# EAGLE design main_new (EAGLE 7.7.0)
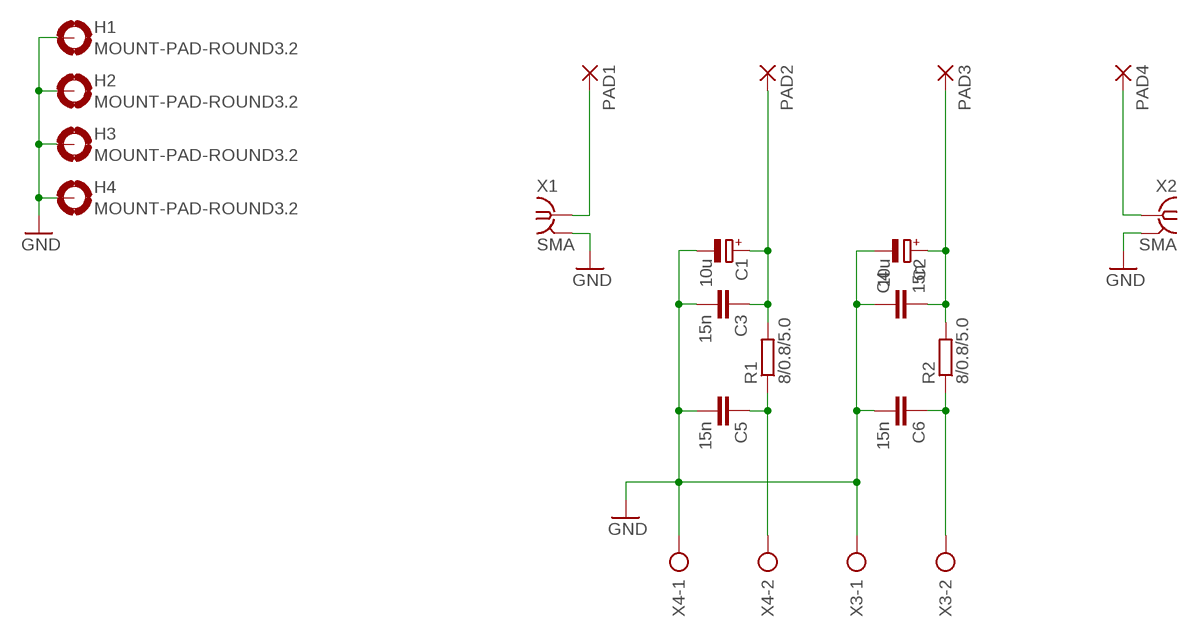
[diagram p0: schematic, sheet 1]

## Parts
C1  10u  CPOL-EUE5-8.5  [E5-8,5]
C2  10u  CPOL-EUE5-8.5  [E5-8,5]
C3  15n  C-EU050-030X075  [C050-030X075]
C4  15n  C-EU050-030X075  [C050-030X075]
C5  15n  C-EU050-030X075  [C050-030X075]
C6  15n  C-EU050-030X075  [C050-030X075]
H1  MOUNT-PAD-ROUND3.2  [3,2-PAD]
H2  MOUNT-PAD-ROUND3.2  [3,2-PAD]
H3  MOUNT-PAD-ROUND3.2  [3,2-PAD]
H4  MOUNT-PAD-ROUND3.2  [3,2-PAD]
PAD1  SMD5  [SMD2,54-5,08]
PAD2  SMD5  [SMD2,54-5,08]
PAD3  SMD5  [SMD2,54-5,08]
PAD4  SMD5  [SMD2,54-5,08]
R1  8/0.8/5.0  R-EU_0411/12  [0411/12]
R2  8/0.8/5.0  R-EU_0411/12  [0411/12]
X1  SMA  SMA-142-0711-821/826  [J502-ND-142-0711-821/826]
X2  SMA  SMA-142-0711-821/826  [J502-ND-142-0711-821/826]
X3  AK500/2  [AK500/2]
X4  AK500/2  [AK500/2]

## Nets
GND: C1.- C2.- C3.2 C4.1 C5.2 C6.2 H1.B3,2(MOUNT) H2.B3,2(MOUNT) H3.B3,2(MOUNT) H4.B3,2(MOUNT) X1.G@1 X1.G@2 X1.G@3 X1.G@4 X2.G@1 X2.G@2 X2.G@3 X2.G@4 X3.1 X4.1
N$1: PAD1.1(P) X1.1
N$2: PAD4.1(P) X2.1
N$3: C6.1 R2.1 X3.2
N$4: C2.+ C4.2 PAD3.1(P) R2.2
N$5: C1.+ C3.1 PAD2.1(P) R1.2
N$6: C5.1 R1.1 X4.2

## Library data of the parts
C1 C2 = rcl:CPOL-EU: POLARIZED CAPACITOR, European symbol
C3-C6 = resistor:C-EU: CAPACITOR, European symbol
H1-H4 = holes:MOUNT-PAD-ROUND: MOUNTING PAD, round
PAD1-PAD4 = wirepad:SMD5: SMD PAD
R1 R2 = rcl:R-EU_: RESISTOR, European symbol
X1 X2 = con-coax:SMA-: SMA 50 Ohm End Launch Jack Receptacle - Round Contact Johnson Components Source: www.johnsoncomponents.com .. J502-ND.pdf; MF: JOHNSON COMPONENTS; MPN: 142-0711-821; OC_FARNELL: 1019328; OC_NEWARK: 16F3627
X3 X4 = con-ptr500:AK500/2: CONNECTOR; OC_FARNELL: unknown; OC_NEWARK: unknown

## Board
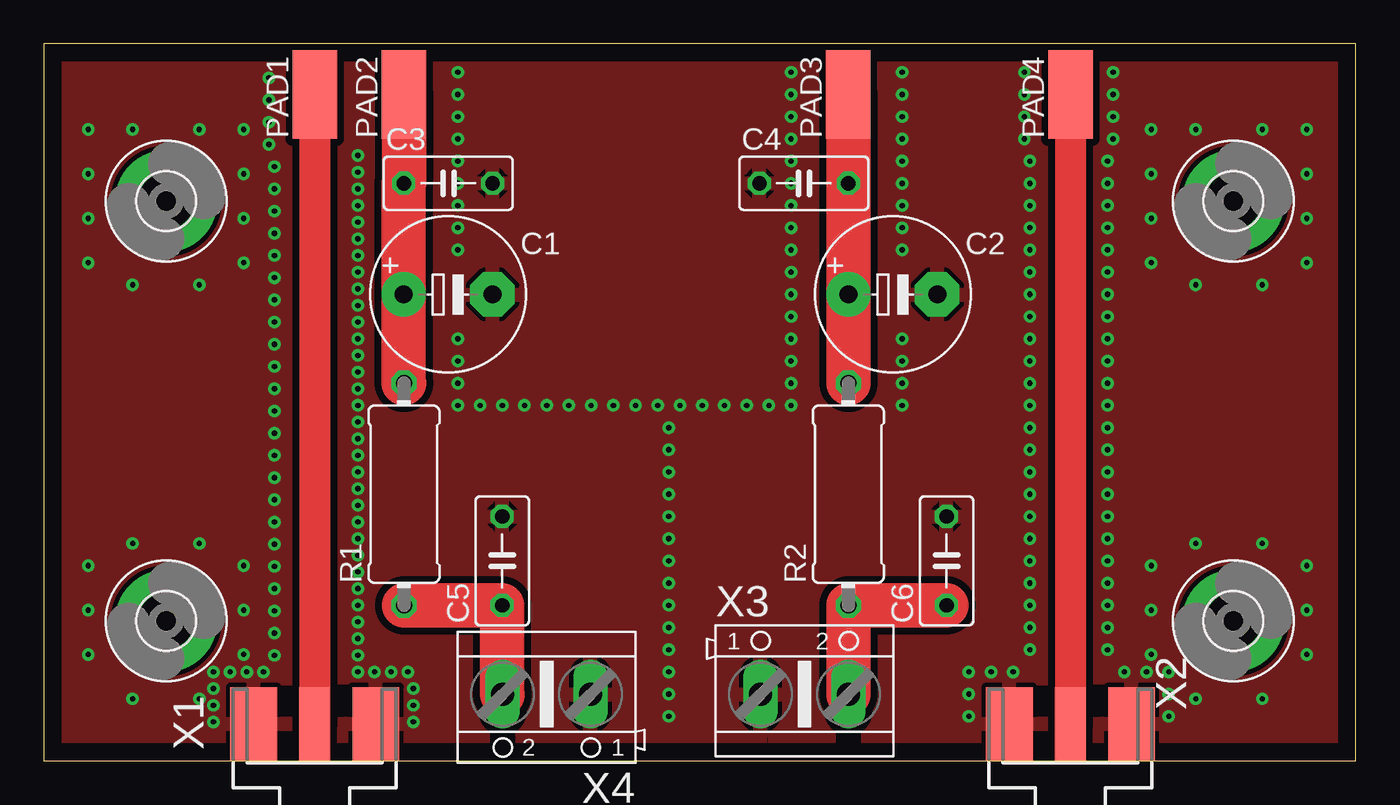
[diagram p1: board, top side]
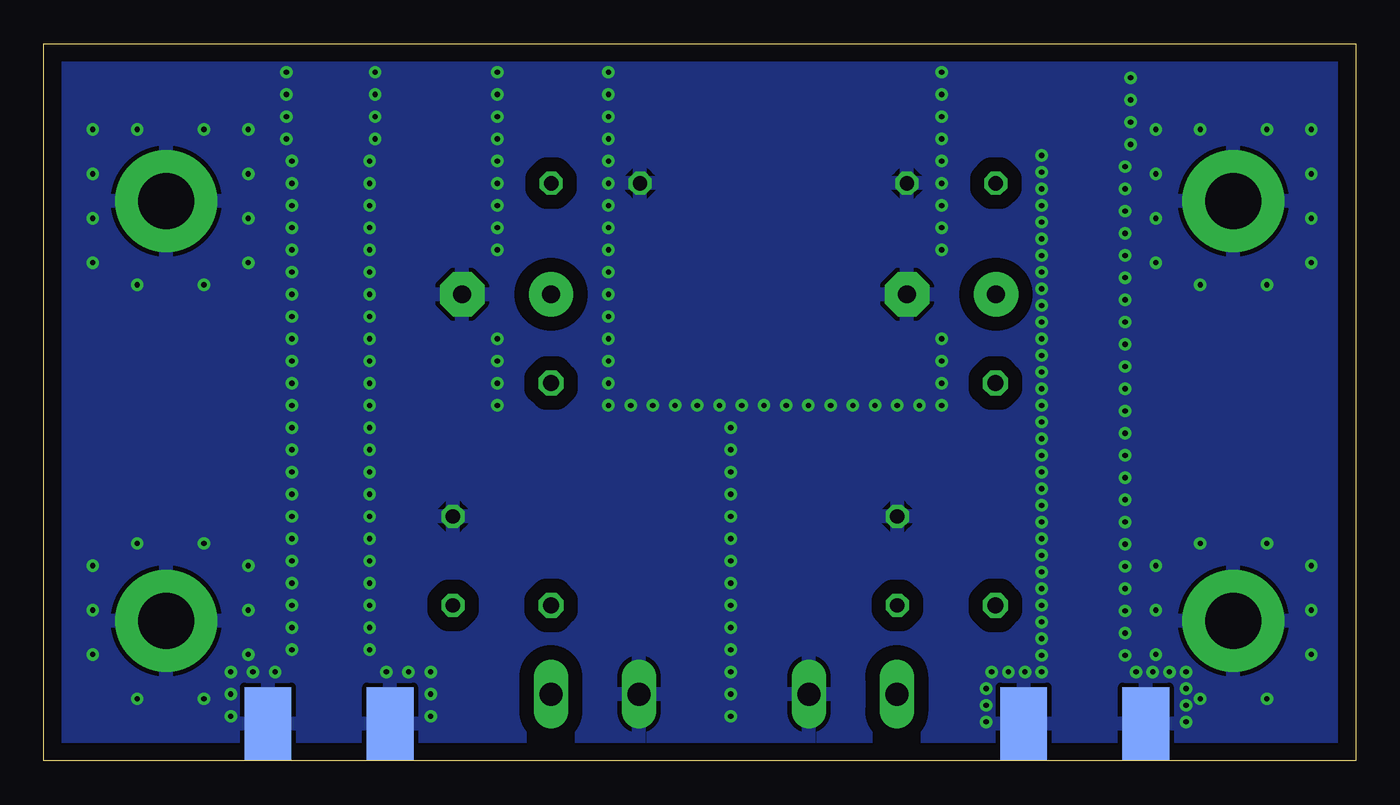
[diagram p2: board, bottom side, seen from below]

Size 75 x 41 mm. Coordinates in mm from the lower left corner, seen from the top.
Outline: 0,0 75,0 75,41 0,41 0,0
Copper layers (1*16): Top 0.035mm / dielectric 1.5mm / Bottom 0.035mm
Design rules "default *": minimum track width 10mil, minimum drill 24mil, track to track 8mil, track to pad 8mil, pad to pad 8mil, via to via 8mil, smd to smd 8mil, copper to edge 40mil, drill to drill 8mil, minimum pad ring 10mil, minimum via ring 8mil, stop-mask expansion 4mil, vias tented up to drill 0.5mm, thermal gap 10mil

### Footprints (pad centres in the part's own frame; a part is rotated, then mirrored left to right if it is on the bottom)
E5-8,5 = drill 1.016 pad 2.54: + -2.54,0 | drill 1.016 pad 2.54 octagon: - 2.54,0
C050-030X075 = drill 0.813 octagon: 1 -2.54,0; 2 2.54,0
3,2-PAD = drill 3.2 pad 5.842: B3,2 0,0
SMD2,54-5,08 = smd 2.54 x 5.08: 1 0,0
0411/12 = drill 0.914 octagon: 1 -6.35,0; 2 6.35,0
J502-ND-142-0711-821/826 = smd 4.191 x 1.778: 1 2.115,0 | smd 4.191 x 2.667: G@1 2.115,3.495; G@2 2.115,-3.495 | smd 4.191 x 2.667 bottom: G@3 2.115,3.495; G@4 2.115,-3.495
AK500/2 = drill 1.321 long: 1 -2.515,0; 2 2.515,0

### Placement (x,y rotation side)
C1  23.11,26.67 0 top
C2  48.54,26.67 0 top
C3  23.12,33.02 0 top
C4  43.45,33.02 0 top
C5  26.21,11.43 90 top
C6  51.61,11.43 90 top
H1  68,32 0 top
H2  68,8 0 top
H3  7,8 0 top
H4  7,32 0 top
PAD1  15.49,38.1 0 top
PAD2  20.59,38.1 0 top
PAD3  45.99,38.1 0 top
PAD4  58.69,38.1 0 top
R1  20.59,15.24 90 top
R2  45.99,15.24 90 top
X1  15.49,0 90 top
X2  58.69,0 90 top
X3  43.49,3.81 0 top
X4  28.75,3.81 180 top

### Tracks (layer width: path | path; a pad name or v marks a point on that pad's centre or on a via)
GND  (via drill 0.3)
  other vias: 2.54,36.1 11.43,36.1 11.43,31.02 11.43,33.56 11.43,28.48 2.54,33.56 2.54,31.02 2.54,28.48 8.89,27.21 5.08,27.21 5.08,36.1 8.89,36.1 8.89,12.43 5.08,12.43 2.54,11.16 2.54,8.62 2.54,6.08 5.08,3.54 8.89,3.54 11.43,6.08 11.43,8.62 11.43,11.16 69.66,12.43 65.85,12.43 63.31,11.16 65.85,3.54 69.66,3.54 72.2,6.08 72.2,8.62 72.2,11.16 65.85,36.1 69.66,36.1 72.2,36.1 72.2,33.56 72.2,31.02 63.31,33.56 63.31,36.1 63.31,31.02 69.66,27.21 72.2,28.48 12.88,39.05 12.88,37.78 12.88,36.51 12.88,35.24 17.95,34.61 23.67,35.56 23.67,38.1 42.72,38.1 42.72,35.56 49.07,38.1 49.07,35.56 56.05,39.37 56.05,38.1 56.05,36.83 56.05,35.56 56.37,34.29 56.37,6.35 60.82,7.62 61.13,39.37 61.13,38.1 61.13,36.83 61.13,35.56 60.82,34.29 13.19,22.54 13.19,21.27 13.19,20 13.19,18.73 13.19,17.46 13.19,16.19 13.19,14.92 13.19,13.65 13.19,12.38 13.19,11.11 13.19,9.84 13.19,8.57 13.19,23.81 13.19,25.08 13.19,26.35 13.19,27.62 13.19,28.89 13.19,30.16 13.19,31.43 13.19,32.7 13.19,33.97 23.67,39.37 23.67,36.83 42.72,36.83 49.07,34.29 49.07,36.83 49.07,39.37 42.72,39.37 42.72,29.21 60.82,6.35 63.04,5.08 64.31,5.08 64.31,3.81 61.77,5.08 54.15,5.08 52.88,2.54 52.88,5.08 52.88,3.81 56.37,7.62 17.95,33.66 17.95,32.7 17.95,31.75 17.95,30.8 17.95,29.84 17.95,28.89 17.95,27.94 17.95,26.99 17.95,26.04 17.95,25.08 17.95,24.13 17.95,23.18 17.95,22.23 17.95,21.27 13.19,7.3 13.19,6.03 55.42,5.08 23.67,30.48 23.67,33.02 23.67,34.29 23.67,31.75 23.67,29.21 23.67,22.86 23.67,24.13 23.67,21.59 30.02,20.32 28.75,20.32 27.48,20.32 26.21,20.32 24.94,20.32 23.67,20.32 35.73,19.05 35.73,17.78 35.73,16.51 35.73,15.24 35.73,13.97 35.73,12.7 35.73,11.43 35.73,10.16 35.73,8.89 35.73,7.62 35.73,6.35 35.73,5.08 41.45,20.32 40.18,20.32 38.91,20.32 37.64,20.32 36.37,20.32 35.1,20.32 33.83,20.32 32.56,20.32 31.29,20.32 35.73,3.81 35.73,2.54 42.72,25.4 42.72,29.21 42.72,27.94 42.72,26.67 42.72,20.32 42.72,22.86 42.72,24.13 42.72,21.59 49.07,33.02 42.72,33.02 42.72,34.29 42.72,31.75 42.72,30.48 49.07,31.75 49.07,30.48 49.07,29.21 49.07,24.13 49.07,22.86 49.07,21.59 49.07,20.32 17.95,20.32 17.95,19.37 17.95,18.41 17.95,17.46 17.95,16.51 17.95,15.56 17.95,14.61 17.95,13.65 17.95,12.7 17.95,11.75 17.95,10.79 17.95,9.84 17.95,8.89 17.95,7.94 17.95,6.99 17.95,6.03 17.95,5.08 18.91,5.08 19.86,5.08 20.81,5.08 21.13,4.13 21.13,3.17 21.13,2.22 9.7,4.13 9.7,2.22 9.7,3.17 9.7,5.08 10.65,5.08 11.61,5.08 12.56,5.08 60.82,25.4 60.82,24.13 60.82,22.86 60.82,21.59 60.82,20.32 60.82,19.05 60.82,17.78 60.82,16.51 60.82,15.24 60.82,13.97 60.82,12.7 60.82,11.43 60.82,26.67 60.82,27.94 60.82,29.21 60.82,30.48 60.82,31.75 60.82,33.02 60.82,10.16 60.82,8.89 56.37,25.4 56.37,24.13 56.37,22.86 56.37,21.59 56.37,20.32 56.37,19.05 56.37,17.78 56.37,16.51 56.37,15.24 56.37,13.97 56.37,12.7 56.37,11.43 56.37,26.67 56.37,27.94 56.37,29.21 56.37,30.48 56.37,31.75 56.37,33.02 56.37,10.16 56.37,8.89 65.85,27.21 63.31,28.48 64.31,2.54 63.31,8.62 63.31,6.08
  pour Top (isolate 0.4): 0,41 75,41 75,0 0,0
  pour Bottom (isolate 0.813): 0,41 75,41 75,0 0,0
N$1
  Top 1.778: PAD1.1 X1.1
N$2
  Top 1.778: PAD4.1 X2.1
N$3
  Top 2.54: X3.2 45.99,3.83 R2.1 C6.1
N$4
  Top 2.54: PAD3.1 C4.2 C2.+ R2.2
N$5
  Top 2.54: PAD2.1 C3.1 C1.+ 20.57,21.61 R1.2
N$6
  Top 2.54: R1.1 C5.1 26.21,3.83 X4.2

### Text on the board
tDocu: PA_BOARD_1.1